# Altium schematic sheet SmartLab.SchDoc
size A
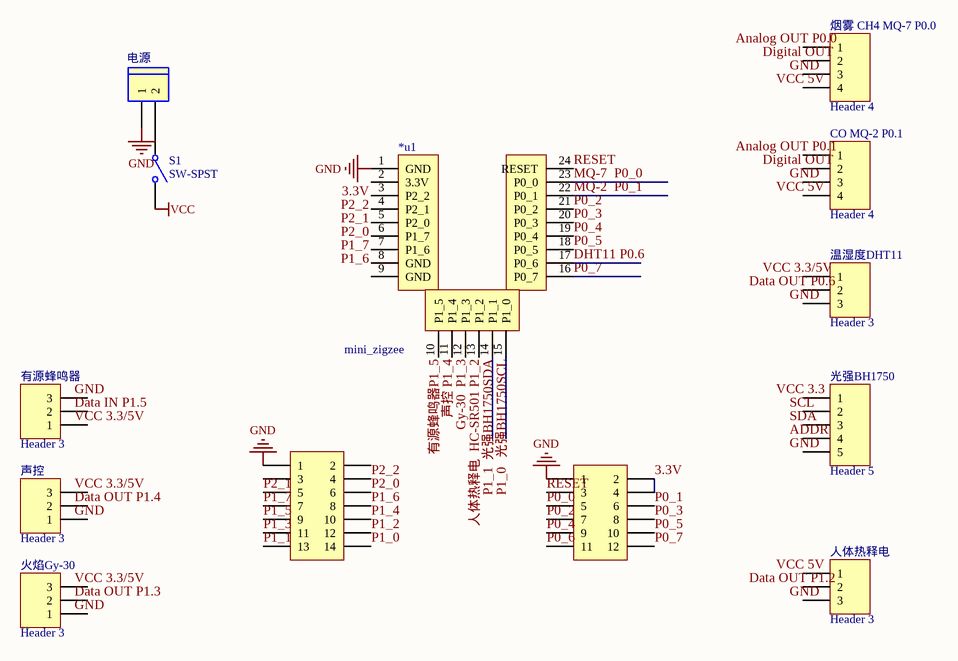
[diagram p0: SmartLab.SchDoc]

## Parts
*u1  mini_zigzee  [mini_zigbee]
CO_MQ-2_P0.1  Header 4  [HDR1X4]
JP2  Header 2X7  [HDR2-7]  (value not drawn)
JP3  Header 2X6  [HDR2-6]  (value not drawn)
S1  SW-SPST  [手电筒开关]
人体热释电  Header 3  [HDR1X3]
光强BH1750  Header 5  [HDR1X5]
声控  Header 3  [HDR1X3]
有源蜂鸣器  Header 3  [HDR1X3]
温湿度DHT11  Header 3  [HDR1X3]
火焰Gy-30  Header 3  [HDR1X3]
烟雾_CH4_MQ-7_P0.0  Header 4  [HDR1X4]
电源  (no value)  [HDR1X2]

## Nets
GND: *u1.1(GND) JP2.1 JP3.1 电源.1
VCC: S1.2(NO)
3.3V: *u1.2(3.3V) JP3.2 JP3.4
DHT11 P0.6: *u1.17(P0_6)
Gy-30  P1_3: *u1.11(P1_4)
MQ-2  P0_1: *u1.22(P0_1)
MQ-7  P0_0: *u1.23(P0_0)
P0_0: JP3.5
P0_1: JP3.6
P0_2: *u1.21(P0_2) JP3.7
P0_3: *u1.20(P0_3) JP3.8
P0_4: *u1.19(P0_4) JP3.9
P0_5: *u1.18(P0_5) JP3.10
P0_6: JP3.11
P0_7: *u1.16(P0_7) JP3.12
P1_0: JP2.14
P1_1: JP2.13
P1_2: JP2.12
P1_3: JP2.11
P1_4: JP2.10
P1_5: JP2.9
P1_6: *u1.7(P1_6) JP2.8
P1_7: *u1.6(P1_7) JP2.7
P2_0: *u1.5(P2_0) JP2.6
P2_1: *u1.4(P2_1) JP2.5
P2_2: *u1.3(P2_2) JP2.4
RESET: *u1.24(RESET) JP3.3
人体热释电  HC-SR501 P1_2: *u1.12(P1_3)
光强BH1750SCL: *u1.14(P1_1)
光强BH1750SDA: *u1.13(P1_2)
声控 P1_4: *u1.10(P1_5)
NetS1_1: S1.1(COMMON) 电源.2

Not connected (* = marked no-connect by the designer): *u1 8(GND) 9(GND) 15(P1_0); CO_MQ-2_P0.1 1 2 3 4; JP2 2 3; 人体热释电 1 2 3; 光强BH1750 1 2 3 4 5; 声控 1 2 3; 有源蜂鸣器 1 2 3; 温湿度DHT11 1 2 3; 火焰Gy-30 1 2 3; 烟雾_CH4_MQ-7_P0.0 1 2 3 4

## Notes on the sheet
- Labels drawn without touching a wire or pin: ADDR, Analog OUT P0.0, Analog OUT P0.1, Data IN P1.5, Data OUT P0.6, Data OUT P1.2, Data OUT P1.3, Data OUT P1.4, Digital OUT, GND, P1_0, P1_1, SCL, SDA, VCC 3.3, VCC 3.3/5V, VCC 5V, 有源蜂鸣器P1_5

## Library data of the parts
CO_MQ-2_P0.1 烟雾_CH4_MQ-7_P0.0 = Header 4: Header, 4-Pin; LatestRevisionDate: 17-Jul-2002; LatestRevisionNote: Re-released for DXP Platform.; Publisher: Altium Limited
JP2 = Header 2X7: Header, 7-Pin, Dual row; Manufacturer: Generic Components; Class: Connector
JP3 = Header 2X6: Header, 6-Pin, Dual row; Manufacturer: Generic Components; Class: Connector
S1 = SW-SPST: Single-Pole, Single-Throw Switch; Manufacturer: Generic Components; Published: 1999
人体热释电 声控 有源蜂鸣器 温湿度DHT11 火焰Gy-30 = Header 3: Header, 3-Pin; LatestRevisionDate: 17-Jul-2002; LatestRevisionNote: Re-released for DXP Platform.; Publisher: Altium Limited
光强BH1750 = Header 5: Header, 5-Pin; LatestRevisionDate: 17-Jul-2002; LatestRevisionNote: Re-released for DXP Platform.; Publisher: Altium Limited
电源 = H-2: Header, 2-Pin; Manufacturer: Generic Components; Class: Connector